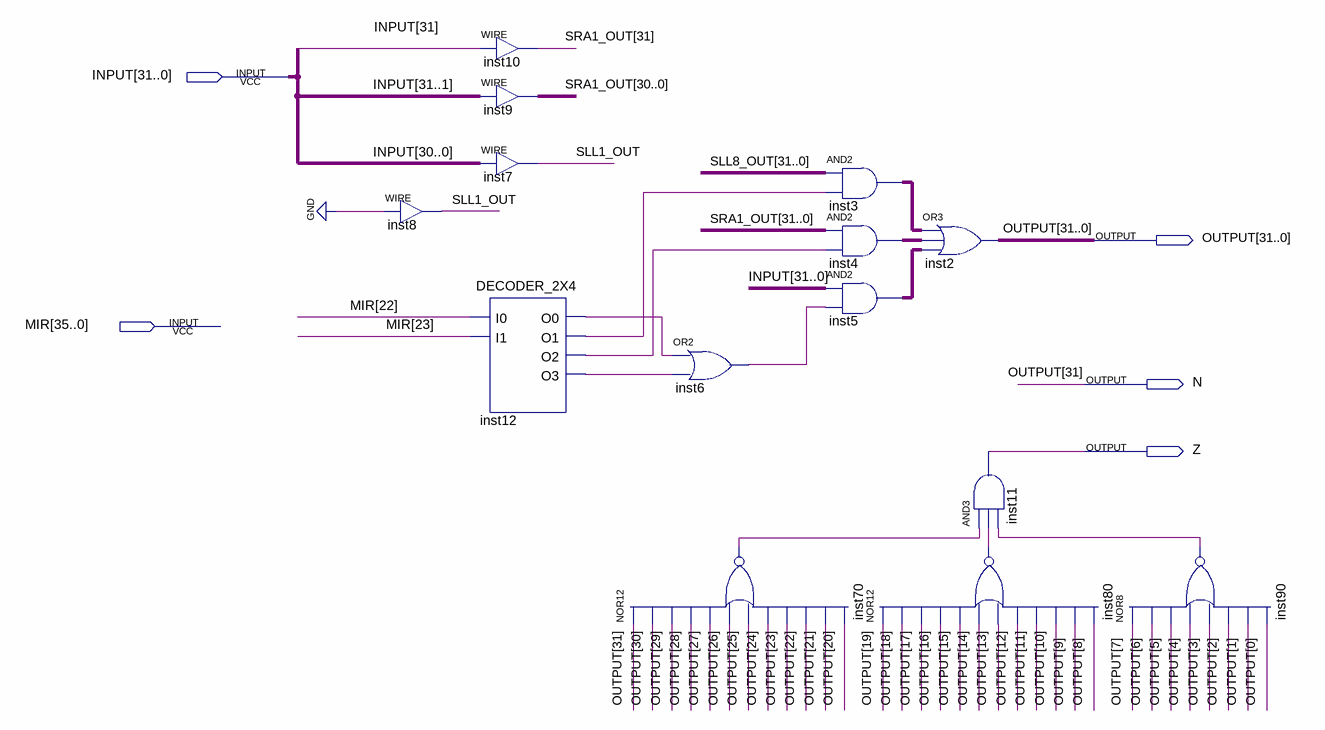
[diagram p0: schematic sheet]
// Quartus schematic SHIFTER.bdf as structural Verilog: 14 symbols, 5 pins
module SHIFTER (
  input  [31:0] INPUT,
  input  [35:0] MIR,
  output [31:0] OUTPUT,
  output N,
  output Z
);

  wire inst6_out, inst12_o0, inst12_o1, inst12_o2, inst12_o3, inst70_out, inst80_out, inst90_out, SLL1_OUT;
  wire [31:0] inst3_out, inst4_out, inst5_out, SLL8_OUT, SRA1_OUT;

  assign SLL1_OUT = 1'b0;  // WIRE inst8
  assign SRA1_OUT[31] = INPUT[31];  // WIRE inst10
  assign SRA1_OUT[30:0] = INPUT[31:1];  // WIRE inst9
  assign SLL1_OUT = INPUT[30:0];  // WIRE inst7
  DECODER_2X4 inst12 (.I0(MIR[22]), .I1(MIR[23]), .O0(inst12_o0), .O1(inst12_o1), .O2(inst12_o2), .O3(inst12_o3));
  or inst6 (inst6_out, inst12_o0, inst12_o3);
  nor inst70 (inst70_out, N, OUTPUT[30], OUTPUT[29], OUTPUT[28], OUTPUT[27], OUTPUT[26], OUTPUT[25], OUTPUT[24], OUTPUT[23], OUTPUT[22], OUTPUT[21], OUTPUT[20]);
  assign inst3_out = SLL8_OUT & {32{inst12_o1}};  // AND2 inst3, 32 bits wide
  assign inst4_out = SRA1_OUT & {32{inst12_o2}};  // AND2 inst4, 32 bits wide
  assign inst5_out = INPUT & {32{inst6_out}};  // AND2 inst5, 32 bits wide
  nor inst80 (inst80_out, OUTPUT[19], OUTPUT[18], OUTPUT[17], OUTPUT[16], OUTPUT[15], OUTPUT[14], OUTPUT[13], OUTPUT[12], OUTPUT[11], OUTPUT[10], OUTPUT[9], OUTPUT[8]);
  assign {N, OUTPUT[30:0]} = inst3_out | inst4_out | inst5_out;  // OR3 inst2, 32 bits wide
  and inst11 (Z, inst70_out, inst80_out, inst90_out);
  nor inst90 (inst90_out, OUTPUT[7], OUTPUT[6], OUTPUT[5], OUTPUT[4], OUTPUT[3], OUTPUT[2], OUTPUT[1], OUTPUT[0]);

  assign OUTPUT[31] = N;
endmodule
